# EAGLE design LiPo-USB-Charger-v13 (EAGLE 5.04)
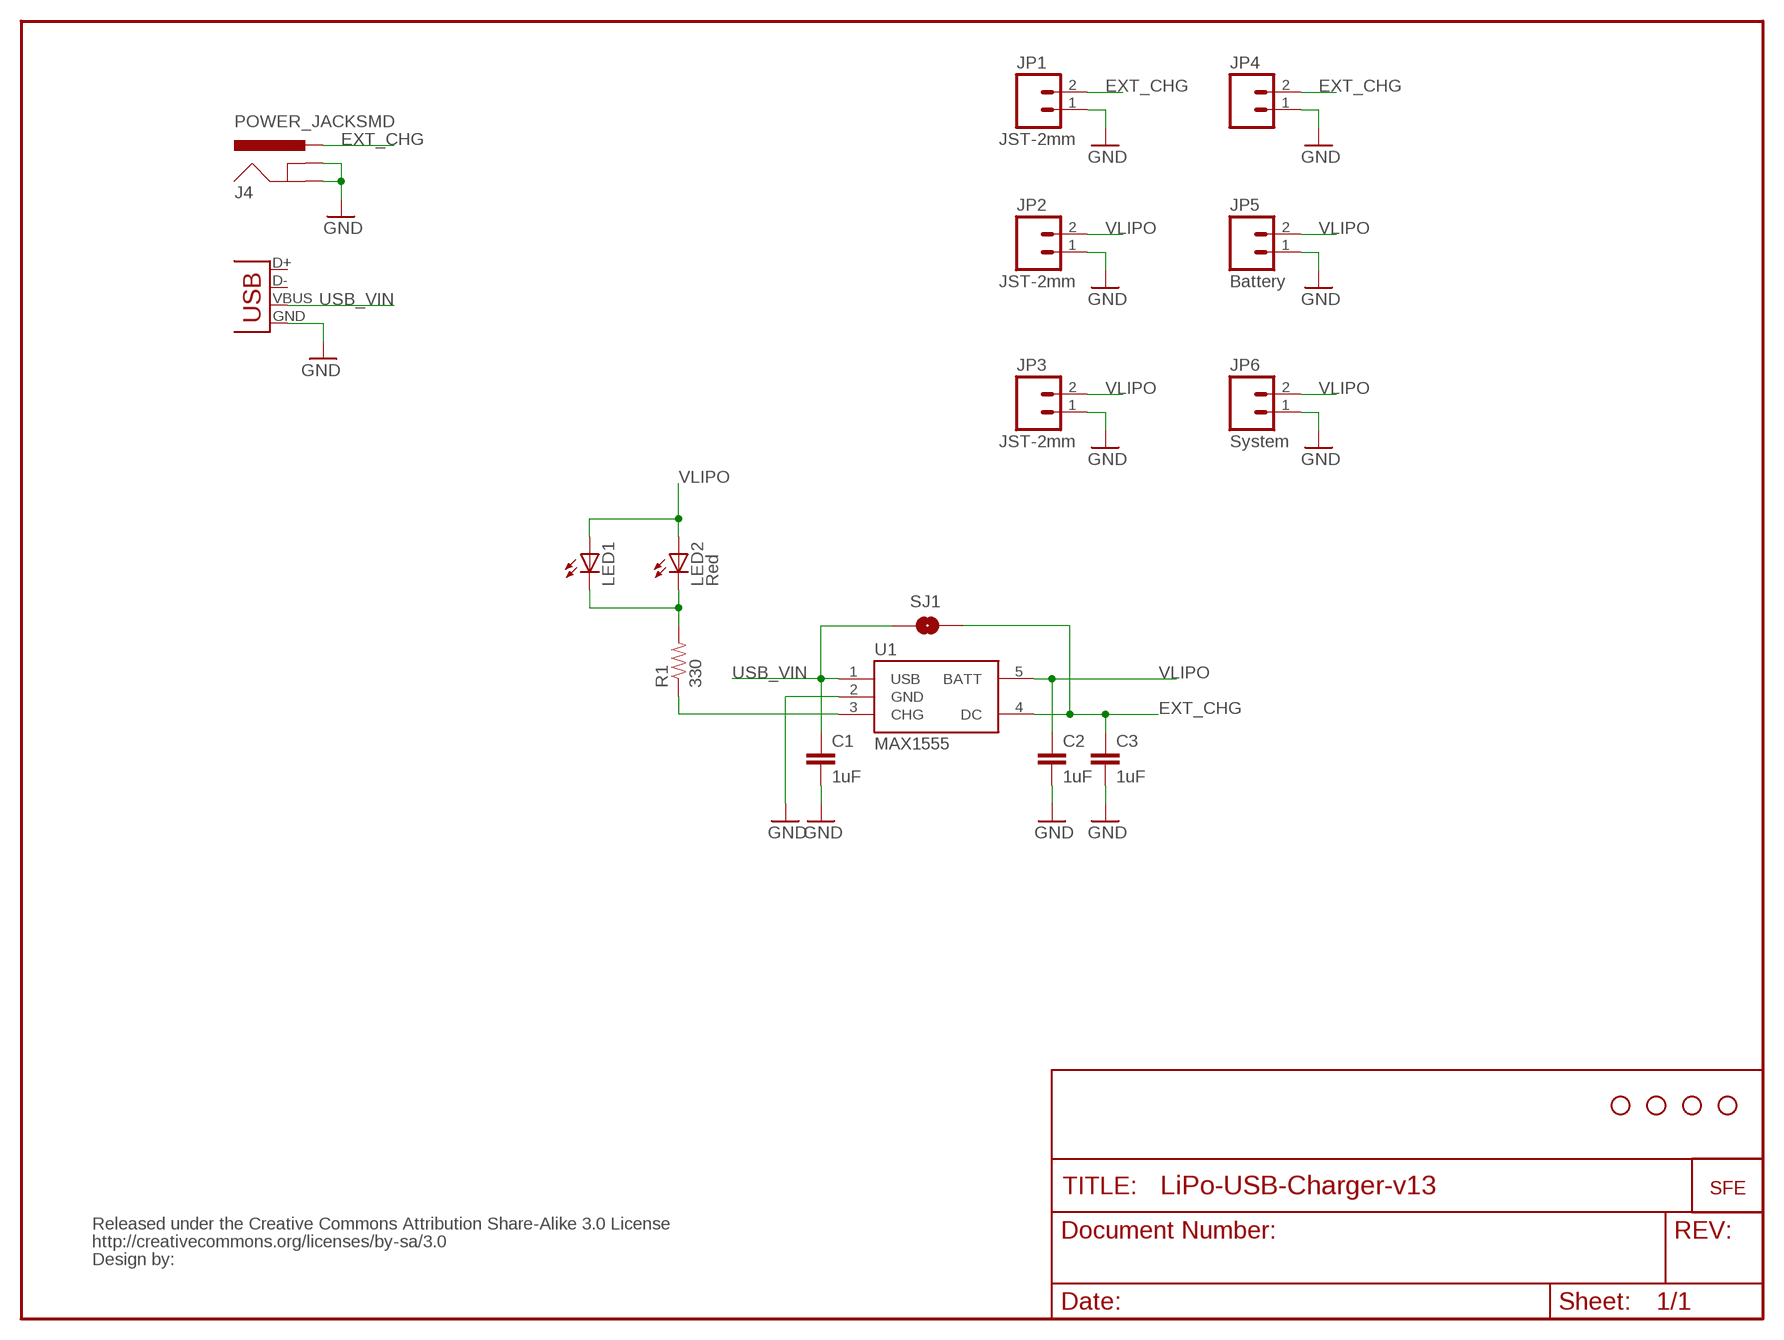
[diagram p0: schematic, sheet 1]

## Parts
C1  1uF  CAP0603  [0603]
C2  1uF  CAP0603  [0603]
C3  1uF  CAP0603  [0603]
J4  POWER_JACKSMD  [POWER_JACK_SMD]
JP1  JST-2mm  M02-JST-2MM-SMT  [S2B-PH]
JP2  JST-2mm  M02-JST-2MM-SMT  [S2B-PH]
JP3  JST-2mm  M02-JST-2MM-SMT  [S2B-PH]
JP4  M02POLAR  [MOLEX-1X2]
JP5  Battery  M02POLAR  [MOLEX-1X2]
JP6  System  M02POLAR  [MOLEX-1X2]
LED1  LED5MM  [LED5MM]
LED2  Red  LED1206  [LED-1206]
R1  330  RESISTOR0603  [0603]
SJ1  SOLDERJUMPERNO  [SJ_2S-NO]
U1  MAX1555  [SOT23-5]
U$1  CREATIVE_COMMONS  [CREATIVE_COMMONS]
U$2  STAND-OFF  [STAND-OFF]
U$3  STAND-OFF  [STAND-OFF]
U$4  STAND-OFF  [STAND-OFF]
U$5  STAND-OFF  [STAND-OFF]
U$7  LOGO-SFENEW  [SFE-NEW-WEBLOGO]
X2  USBSMD  [USB-MINIB]

## Nets
CHG_STAT: R1.1 U1.3(CHG)
EXT_CHG: C3.1 J4.VIN0(PWR) JP1.2 JP4.2 SJ1.2 U1.4(DC)
GND [power]: C1.2 C2.2 C3.2 J4.GND(GNDBREAK) J4.P$4(GND) JP1.1 JP2.1 JP3.1 JP4.1 JP5.1 JP6.1 U1.2(GND) X2.GND
N$1: LED1.K(C) LED2.C R1.2
USB_VIN: C1.1 SJ1.1 U1.1(USB) X2.VBUS
VLIPO [power]: C2.1 JP2.2 JP3.2 JP5.2 JP6.2 LED1.A LED2.A U1.5(BATT)
Unconnected: X2.D+ X2.D-

## Library data of the parts
C1-C3 = SparkFun:CAP: Capacitor Standard 0603 ceramic capacitor, and 0.1" leaded capacitor.
J4 = SparkFun:POWER_JACK: Power Jack This is the standard 5.5mm barrel jack for power. The PTH is the most common, proven, reliable, footprint. All others are experimental. The Slot footprint only works if the mill layer is transmitted to the PCB fab house so be warned. Spark Fun Electronics SKU : PRT-00119. Mating wall wart : TOL-00298 (and others)
JP1-JP6 = SparkFun:M02: Header 2 Standard 2-pin 0.1" header. Use with straight break away headers (SKU : PRT-00116), right angle break away headers (PRT-00553), swiss pins (PRT-00743), machine pins (PRT-00117), and female headers (PRT-00115). Molex polarized connector foot print use with SKU : PRT-08233 with associated crimp pins and housings.
LED1 LED2 = SparkFun:LED: LEDs Standard schematic elements and footprints for 5mm, 3mm, 1206, and 0603 sized LEDs. 5mm - Spark Fun Electronics SKU : COM-00529 (and others)
R1 = SparkFun:RESISTOR: Resistor Basic schematic elements and footprints for 0603, 1206, and PTH 1/10th watt (small) resistors.
SJ1 = SparkFun:SOLDERJUMPER: Solder Jumper Standard SMD solder jumper. Used to automate production. Two varients : Normally Open and Normally Closed are the same, but have different paste layers. NC will have a large amount of paste and should jumper during reflow.
U1 = SparkFun:MAX1555: MAX1555 Lithium Charger IC SOT-23 Lithium Polymer charging IC. Schematic element and footprint proven. Spark Fun Electronics SKU : COM-00674
U$1 = SparkFun:CREATIVE_COMMONS
U$2-U$5 = SparkFun:STAND-OFF: Stand Off This is the mechanical footprint for a #4 phillips button head screw. Use the keepout ring to avoid running the screw head into surrounding components. SKU : PRT-00447
U$7 = SparkFun:LOGO-SFE: Spark Fun Electronics PCB Logo This is the standard Spark Fun Electronics PCB logo.
X2 = SparkFun:USB: USB Connectors USB-B-PTH is fully proven SKU : PRT-00139 USB-miniB is fully proven SKU : PRT-00587 USB-A-PCB is untested. USB-A-H is throughly reviewed, but untested. Spark Fun Electronics SKU : PRT-00437 USB-B-SMT is throughly reviewed, but untested. Needs silkscreen touching up. USB-A-S has not been used/tested USB-MB-H has not been used/tested

## Net classes
0 default: width 0.203 mm
1 power: width 0.203 mm

## Board
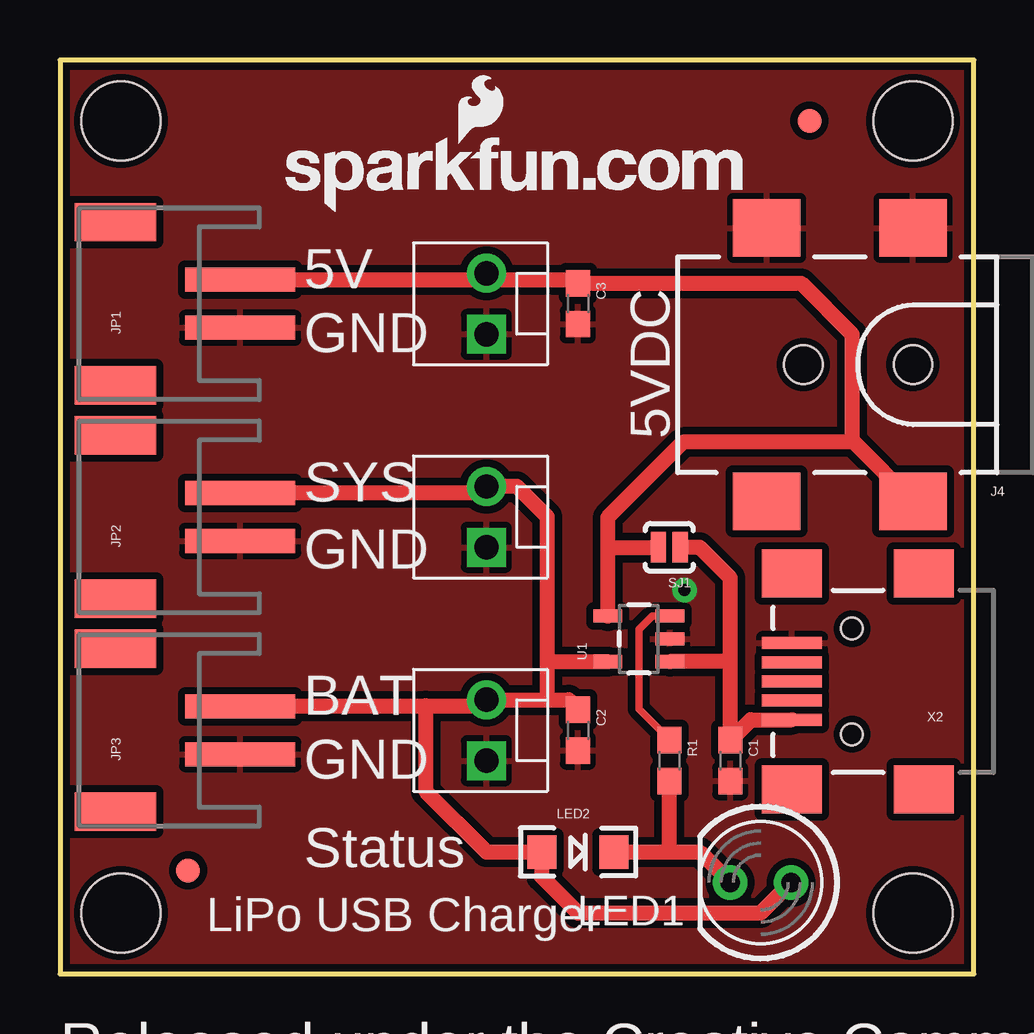
[diagram p1: board, top side]
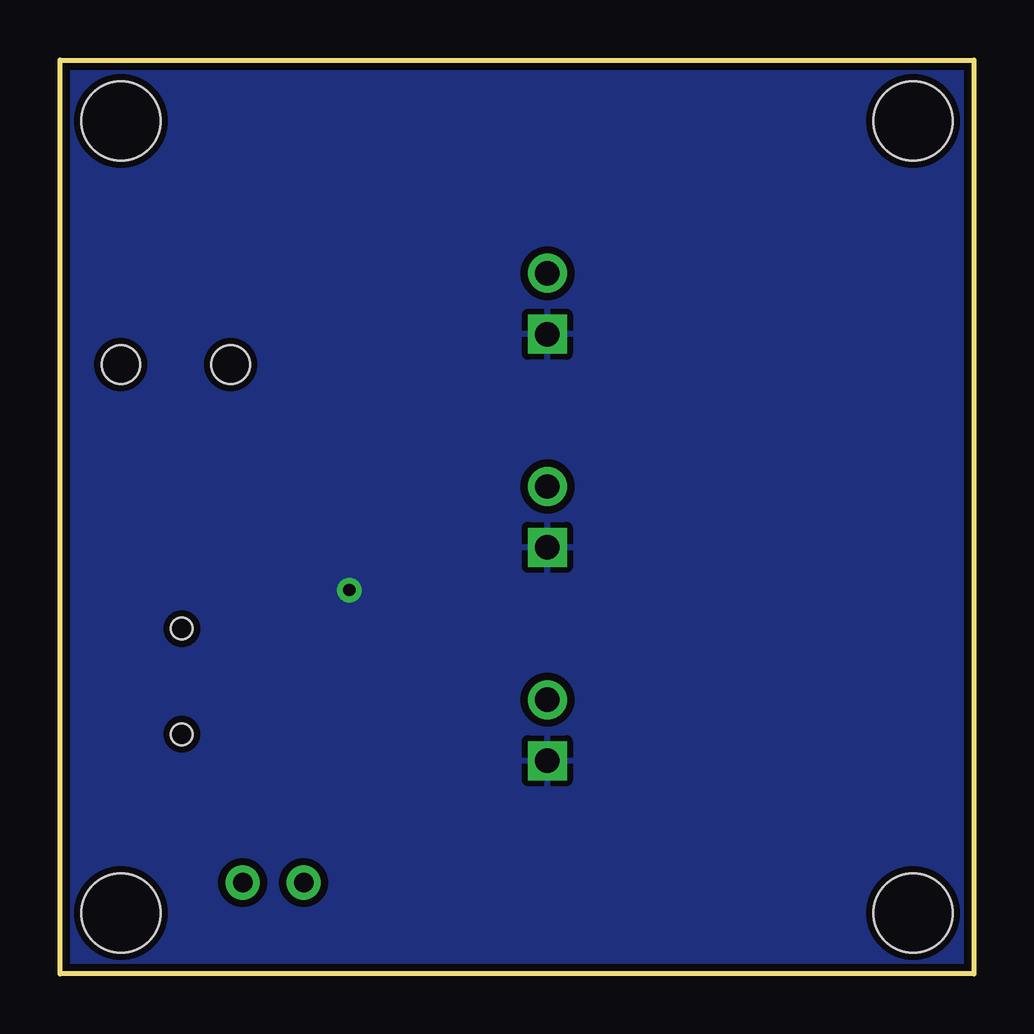
[diagram p2: board, bottom side, seen from below]

Size 38.1 x 38.1 mm. Coordinates in mm from the lower left corner, seen from the top.
Outline: 38.1,0 38.1,38.1 0,38.1 0,0 38.1,0
Copper layers (1*16): Top 0.035mm / dielectric 1.5mm / Bottom 0.035mm
Design rules "SparkFun": minimum track width 8mil, minimum drill 20mil, track to track 8mil, track to pad 8mil, pad to pad 8mil, via to via 8mil, smd to smd 8mil, copper to edge 10mil, drill to drill 8mil, minimum pad ring 12mil, minimum via ring 10mil, stop-mask expansion 4mil, vias tented up to drill 20mil, thermal gap 10mil

### Footprints (pad centres in the part's own frame; a part is rotated, then mirrored left to right if it is on the bottom)
0603 = smd 1.1 x 1: 1 -0.85,0; 2 0.85,0
POWER_JACK_SMD = smd 2.8 x 2.4: GND 0,-5.7; P$4 6.1,-5.7; VIN0 0,5.7; VIN1 6.1,5.7 | hole 1.6: 0,0; 4.572,0
S2B-PH = smd 1 x 4.6: 1 -1,-3.7; 2 1,-3.7 | smd 1.6 x 3.4: NC1 -3.4,1.5; NC2 3.4,1.5
MOLEX-1X2 = drill 1.016 square: 1 0,0 | drill 1.016 round: 2 2.54,0
LED5MM = drill 0.813 round: A -1.27,0; K 1.27,0
LED-1206 = smd 1.2 x 1.4: A -1.5,0; C 1.5,0
SJ_2S-NO = smd 0.635 x 1.27: 1 -0.45,0; 2 0.45,0
SOT23-5 = smd 0.55 x 1.2: 1 -0.95,-1.3; 2 0,-1.3; 3 0.95,-1.3; 4 0.95,1.3; 5 -0.95,1.3
STAND-OFF = hole 3.302: 0,0
FIDUCIAL-1X2 = smd 1 x 1: 1 0,0
USB-MINIB = smd 2.5 x 0.5: D+ 2.5,0; D- 2.5,0.8; GND 2.5,-1.6; ID 2.5,-0.8; VBUS 2.5,1.6 | smd 2.5 x 2: GND@1 -3,-4.5; GND@2 -3,4.5; GND@3 2.5,4.5; GND@4 2.5,-4.5 | hole 0.9: 0,2.2; 0,-2.2

### Placement (x,y rotation side)
C1  27.94,8.89 270 top
C2  21.59,10.16 270 top
C3  21.59,27.94 270 top
J4  35.56,25.4 180 top
JP1  3.81,27.94 90 top
JP2  3.81,19.05 90 top
JP3  3.81,10.16 90 top
JP4  17.78,26.67 90 top
JP5  17.78,8.89 90 top
JP6  17.78,17.78 90 top
LED1  29.21,3.81 180 top
LED2  21.59,5.08 0 top
R1  25.4,8.89 270 top
SJ1  25.4,17.78 180 top
U1  24.13,13.97 90 top
U$1  20.32,-8.89 0 top  (outside the outline)
U$2  2.54,2.54 0 top
U$3  2.54,35.56 0 top
U$4  35.56,35.56 0 top
U$5  35.56,2.54 0 top
U$6  FIDUCIAL1X2  [FIDUCIAL-1X2]  5.33,4.32 0 top
U$7  9.4,31.75 0 top
U$8  FIDUCIAL1X2  [FIDUCIAL-1X2]  31.24,35.56 0 top
X2  33.02,12.19 180 top

### Tracks (layer width: path | path; a pad name or v marks a point on that pad's centre or on a via)
CHG_STAT
  Top 0.305: U1.3 24.7,14.92 24.13,14.35 24.13,11.05 25.4,9.78 R1.1
EXT_CHG
  Top 0.635: JP1.2 17.78,28.94 | 17.78,28.94 JP4.2 | C3.1 21.59,28.7 21.35,28.94 17.78,28.94 | 21.72,28.83 21.68,28.79 C3.1 | 22.83,17.78 U1.4 | 22.83,17.78 SJ1.2 | C3.1 30.9,28.79 33.02,26.67 33.02,22.24 33.09,22.17 | 33.09,22.17 J4.VIN0 | 22.83,17.78 22.83,19.02 25.98,22.17 33.09,22.17
GND  (via drill 0.51)
  other vias: 26.04,16
  pour Bottom (isolate 0.305): 0,38.1 38.1,38.1 38.1,0 0,0
  pour Top (isolate 0.305): 0,38.1 38.1,38.1 38.1,0 0,0
N$1
  Top 0.635: LED2.C 25.4,5.08 | 25.4,5.08 26.67,5.08 LED1.K | 25.4,5.08 R1.2
USB_VIN
  Top 0.635: SJ1.1 26.67,17.78 27.94,16.51 27.94,13.08 | 27.94,13.08 C1.1 28.79,10.59 X2.VBUS | U1.1 27.88,13.02 27.94,13.08
VLIPO
  Top 0.635: 17.78,20.05 JP2.2 | 17.78,20.05 JP6.2 | C2.1 21.59,10.92 | C2.1 21.46,11.14 | 20.32,11.43 JP5.2 17.65,11.3 17.65,11.18 15.24,11.18 | 17.78,20.05 18.05,20.32 19.05,20.32 20.32,19.05 20.32,13.08 | JP3.2 7.53,11.18 15.24,11.18 | 15.24,11.18 15.24,7.62 17.78,5.08 LED2.A 20.09,4.98 20.07,4.95 20.07,4.06 21.59,2.54 29.21,2.54 LED1.A | 20.32,11.43 20.32,13.08 | 20.32,13.08 20.45,13.08 20.51,13.02 U1.5 | C2.1 21.59,11.05 21.21,11.43 20.32,11.43

### Text on the board
tPlace: 5V | 5VDC | GND | SYS | GND | BAT | GND | Status | LiPo USB Charger
tValues: DNP | DNP | DNP